# Altium schematic sheet Tead_Aliens_64A_Main.SchDoc: Tead Aliens on ATMega64A(Main)
size A4; Date: 21/01/2021; ApprovedBy: NeperMath; CheckedBy: NeperMath; Author: NeperMath; DrawnBy: NeperMath; Engineer: NeperMath; Address1: Tead Alien Clock; Address2: on ATMega64A; Address3: AVR Risc microcontroller; Address4: displays (8x8) 3x2; DocumentNumber: 1; Revision: 1; SheetNumber: 1; SheetTotal: 1; CurrentTime: 00:57; CurrentDate: 21/01/2021; Time: 00:56
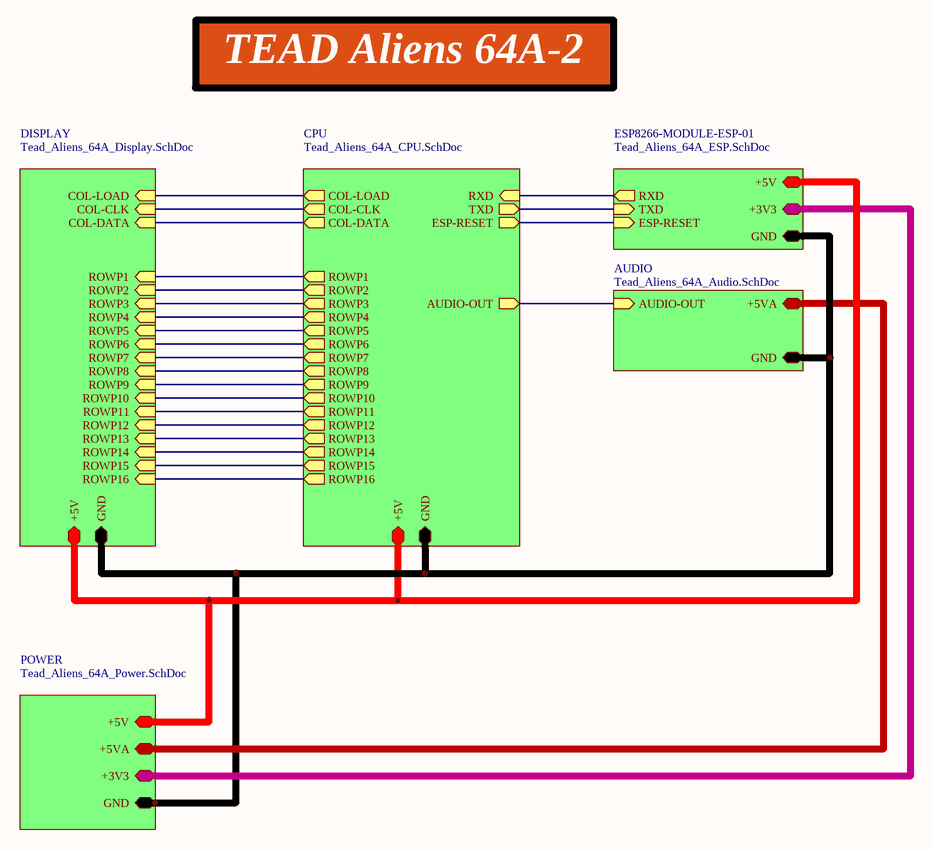
[diagram p0: Tead_Aliens_64A_Main.SchDoc]

## Sub-sheets
AUDIO = Tead_Aliens_64A_Audio.SchDoc: AUDIO-OUT (in), GND, +5VA
CPU = Tead_Aliens_64A_CPU.SchDoc: COL-LOAD (out), COL-CLK (out), COL-DATA (out), ROWP1 (out), ROWP2 (out), ROWP3 (out), ROWP4 (out), ROWP5 (out), ROWP6 (out), ROWP8 (out), ROWP9 (out), ROWP10 (out), ROWP11 (out), ROWP12 (out), ROWP13 (out), ROWP14 (out), ROWP15 (out), ROWP16 (out), RXD (in), TXD (out), AUDIO-OUT (out), ESP-RESET (out), +5V, GND, ROWP7 (out)
DISPLAY = Tead_Aliens_64A_Display.SchDoc: COL-LOAD (in), COL-CLK (in), COL-DATA (in), ROWP1 (in), ROWP2 (in), ROWP3 (in), ROWP4 (in), ROWP5 (in), ROWP6 (in), ROWP7 (in), ROWP8 (in), ROWP9 (in), ROWP10 (in), ROWP11 (in), ROWP12 (in), ROWP13 (in), ROWP14 (in), ROWP15 (in), ROWP16 (in), +5V, GND
ESP8266-MODULE-ESP-01 = Tead_Aliens_64A_ESP.SchDoc: RXD (out), TXD (in), ESP-RESET (in), +5V, +3V3, GND
POWER = Tead_Aliens_64A_Power.SchDoc: +5V, +5VA, +3V3, GND

## Nets
(unnamed): sheet DISPLAY/COL-LOAD, sheet CPU/COL-LOAD
(unnamed): sheet DISPLAY/COL-CLK, sheet CPU/COL-CLK
(unnamed): sheet DISPLAY/COL-DATA, sheet CPU/COL-DATA
(unnamed): sheet DISPLAY/ROWP1, sheet CPU/ROWP1
(unnamed): sheet DISPLAY/ROWP2, sheet CPU/ROWP2
(unnamed): sheet DISPLAY/ROWP3, sheet CPU/ROWP3
(unnamed): sheet DISPLAY/ROWP4, sheet CPU/ROWP4
(unnamed): sheet DISPLAY/ROWP5, sheet CPU/ROWP5
(unnamed): sheet DISPLAY/ROWP6, sheet CPU/ROWP6
(unnamed): sheet DISPLAY/ROWP7, sheet CPU/ROWP7
(unnamed): sheet DISPLAY/ROWP8, sheet CPU/ROWP8
(unnamed): sheet DISPLAY/ROWP9, sheet CPU/ROWP9
(unnamed): sheet DISPLAY/ROWP10, sheet CPU/ROWP10
(unnamed): sheet DISPLAY/ROWP11, sheet CPU/ROWP11
(unnamed): sheet DISPLAY/ROWP12, sheet CPU/ROWP12
(unnamed): sheet DISPLAY/ROWP13, sheet CPU/ROWP13
(unnamed): sheet DISPLAY/ROWP14, sheet CPU/ROWP14
(unnamed): sheet DISPLAY/ROWP15, sheet CPU/ROWP15
(unnamed): sheet DISPLAY/ROWP16, sheet CPU/ROWP16
(unnamed): sheet DISPLAY/+5V, sheet CPU/+5V, sheet ESP8266-MODULE-ESP-01/+5V, sheet POWER/+5V
(unnamed): sheet DISPLAY/GND, sheet CPU/GND, sheet ESP8266-MODULE-ESP-01/GND, sheet AUDIO/GND, sheet POWER/GND
(unnamed): sheet CPU/RXD, sheet ESP8266-MODULE-ESP-01/RXD
(unnamed): sheet CPU/TXD, sheet ESP8266-MODULE-ESP-01/TXD
(unnamed): sheet CPU/AUDIO-OUT, sheet AUDIO/AUDIO-OUT
(unnamed): sheet CPU/ESP-RESET, sheet ESP8266-MODULE-ESP-01/ESP-RESET
(unnamed): sheet ESP8266-MODULE-ESP-01/+3V3, sheet POWER/+3V3
(unnamed): sheet AUDIO/+5VA, sheet POWER/+5VA

## Notes on the sheet
- TEAD Aliens 64A-2
- Title
- Size:
- Date:
- A4
- Number:
- Time:
- Revision:
- Sheet
- of
- File: